# EAGLE design mmc2 (EAGLE 5.03)
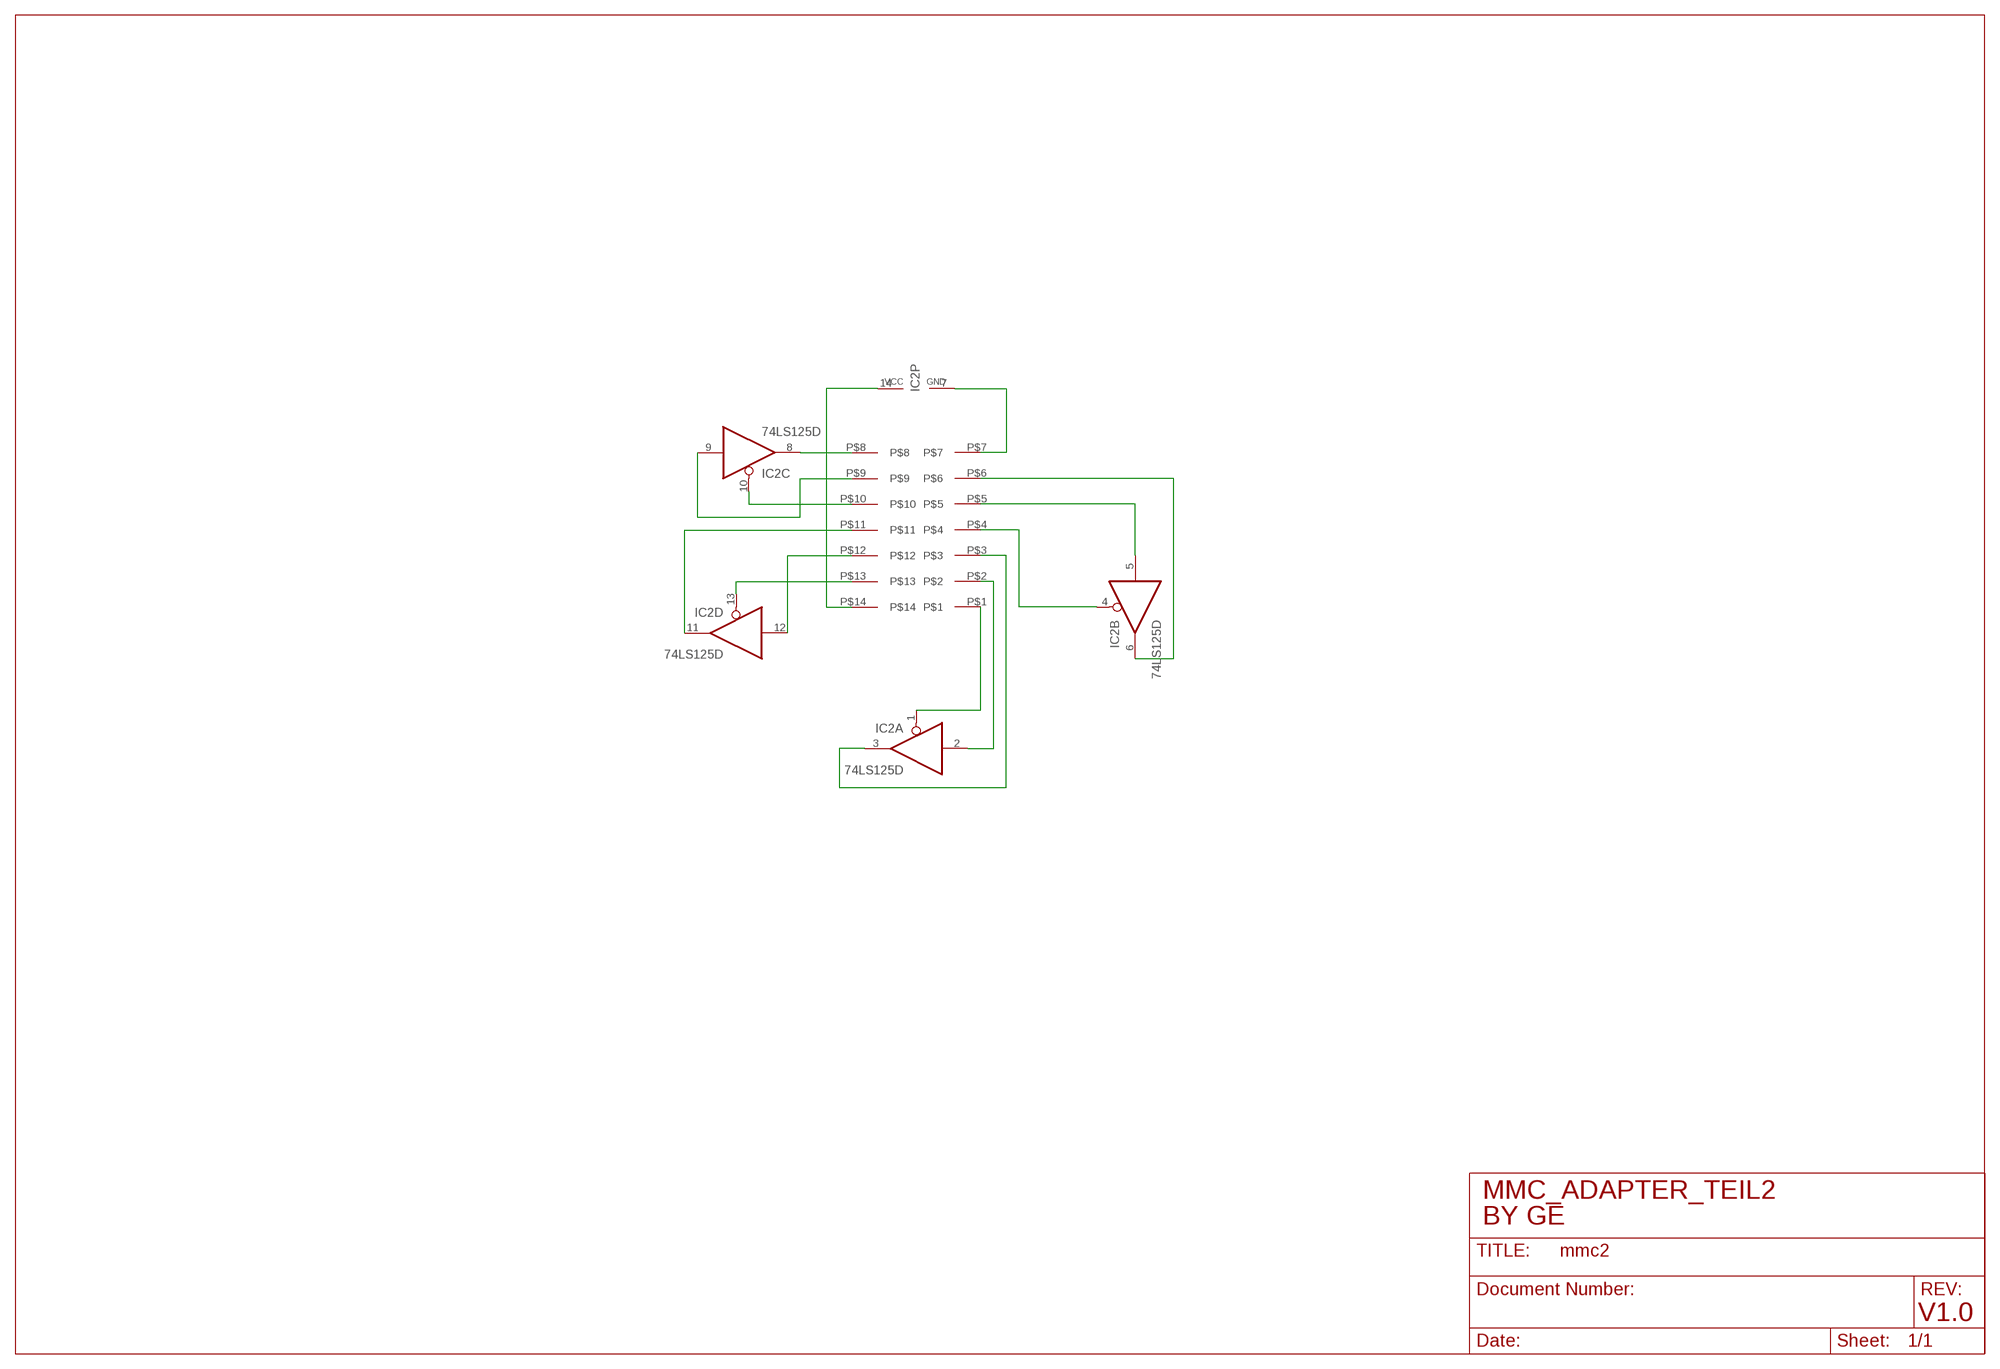
[diagram p0: schematic, sheet 1]

## Parts
IC2  74LS125D  [SO14]
U$1  SO14_DILARGE14  [SO14_DILARGE14]

## Nets
N$3: IC2.1(A:OE) U$1.P$1
N$4: IC2.2(A:I) U$1.P$2
N$5: IC2.3(A:O) U$1.P$3
N$6: IC2.4(B:OE) U$1.P$4
N$7: IC2.5(B:I) U$1.P$5
N$8: IC2.6(B:O) U$1.P$6
N$9: IC2.8(C:O) U$1.P$8
N$10: IC2.9(C:I) U$1.P$9
N$11: IC2.10(C:OE) U$1.P$10
N$12: IC2.11(D:O) U$1.P$11
N$13: IC2.12(D:I) U$1.P$12
N$14: IC2.13(D:OE) U$1.P$13
N$15: IC2.14(P:VCC) U$1.P$14
N$16: IC2.7(P:GND) U$1.P$7

## Notes on the sheet
- MMC_ADAPTER_TEIL2
- BY GE
- V1.0

## Library data of the parts
IC2 = 74xx-eu:74*125: Quad bus BUFFER, 3-state
U$1 = ge01:SO14_DILARGE14

## Board
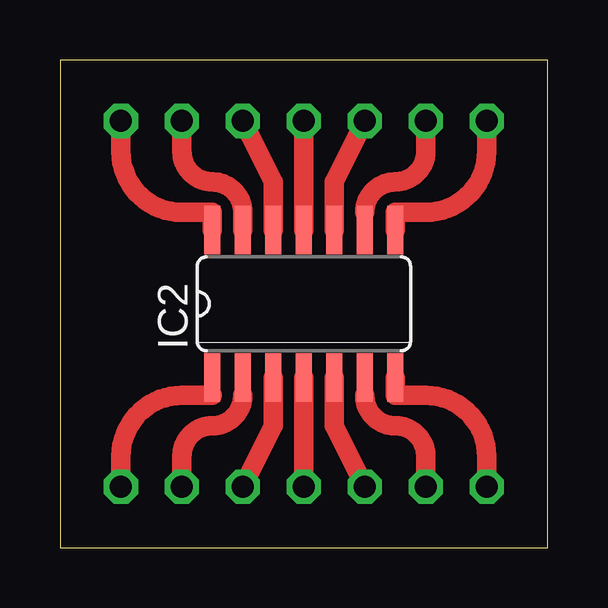
[diagram p1: board, top side]

Size 20.32 x 20.32 mm. Coordinates in mm from the lower left corner, seen from the top.
Outline: 0,0 20.32,0 20.32,20.32 0,20.32 0,0
Copper layers (1*16): Top 0.035mm / dielectric 1.5mm / Bottom 0.035mm
Design rules "0.35mm *": minimum track width 10mil, minimum drill 24mil, track to track 0.35mm, track to pad 0.35mm, pad to pad 0.35mm, via to via 0.35mm, smd to smd 0.35mm, copper to edge 40mil, drill to drill 8mil, minimum pad ring 10mil, minimum via ring 8mil, stop-mask expansion 4mil, vias tented up to drill 0mil, thermal gap 10mil

### Footprints (pad centres in the part's own frame; a part is rotated, then mirrored left to right if it is on the bottom)
SO14 = smd 0.66 x 2.032: 1 -3.81,-3.073; 2 -2.54,-3.073; 3 -1.27,-3.073; 4 0,-3.073; 5 1.27,-3.073; 6 2.54,-3.073; 7 3.81,-3.073; 8 3.81,3.073; 9 2.54,3.073; 10 1.27,3.073; 11 0,3.073; 12 -1.27,3.073; 13 -2.54,3.073; 14 -3.81,3.073
SO14_DILARGE14 = drill 0.914 octagon: P$1 0,0; P$2 2.54,0; P$3 5.08,0; P$4 7.62,0; P$5 10.16,0; P$6 12.7,0; P$7 15.24,0; P$8 15.24,15.24; P$9 12.7,15.24; P$10 10.16,15.24; P$11 7.62,15.24; P$12 5.08,15.24; P$13 2.54,15.24; P$14 0,15.24

### Placement (x,y rotation side)
IC2  10.16,10.16 0 top
U$1  2.54,2.54 0 top

### Tracks (layer width: path | path; a pad name or v marks a point on that pad's centre or on a via)
N$3
  Top 0.61: 6.35,6.35 IC2.1
  Top 0.813: 6.35,6.35 5.08,6.35 arc90 2.54,3.81 U$1.P$1
N$4
  Top 0.61: 7.62,6.35 IC2.2
  Top 0.813: 7.62,6.35 arc-90 6.35,5.08 arc90 5.08,3.81 U$1.P$2
N$5
  Top 0.813: IC2.3 8.89,5.08 U$1.P$3
N$6
  Top 0.813: U$1.P$4 IC2.4
N$7
  Top 0.813: IC2.5 11.43,5.08 U$1.P$5
N$8
  Top 0.61: 12.7,6.35 IC2.6
  Top 0.813: 12.7,6.35 arc90 13.97,5.08 arc-90 15.24,3.81 U$1.P$6
N$9
  Top 0.813: IC2.8 13.97,13.97 15.24,13.97 arc90 17.78,16.51 U$1.P$8
N$10
  Top 0.61: IC2.9 12.7,13.97
  Top 0.813: 12.7,13.97 arc-90 13.97,15.24 arc90 15.24,16.51 U$1.P$9
N$11
  Top 0.813: IC2.10 11.43,15.24 U$1.P$10
N$12
  Top 0.813: IC2.11 U$1.P$11
N$13
  Top 0.813: IC2.12 8.89,15.24 U$1.P$12
N$14
  Top 0.813: IC2.13 7.62,13.97 arc90 6.35,15.24 arc-90 5.08,16.51 U$1.P$13
N$15
  Top 0.813: IC2.14 6.35,13.97 5.08,13.97 arc-90 2.54,16.51 U$1.P$14
N$16
  Top 0.813: IC2.7 13.97,6.35 15.24,6.35 arc-90 17.78,3.81 U$1.P$7